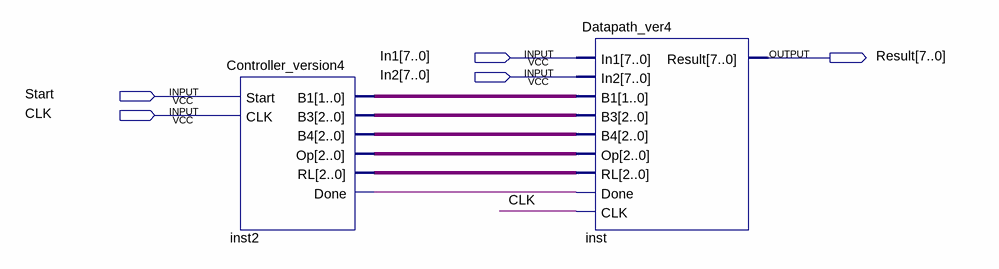
[diagram p0: schematic sheet]
// Quartus schematic version4.bdf as structural Verilog: 2 symbols, 5 pins
module version4 (
  input  [7:0] In1,
  input  [7:0] In2,
  input  Start,
  input  CLK,
  output [7:0] Result
);

  wire inst2_done;
  wire [1:0] inst2_b1;
  wire [2:0] inst2_b3, inst2_b4, inst2_op, inst2_rl;

  Controller_version4 inst2 (
    .Start(Start), .CLK(CLK), .B1(inst2_b1), .B3(inst2_b3), .B4(inst2_b4), .Op(inst2_op), .RL(inst2_rl),
    .Done(inst2_done));
  Datapath_ver4 inst (
    .In1(In1), .In2(In2), .B1(inst2_b1), .B3(inst2_b3), .B4(inst2_b4), .Op(inst2_op), .RL(inst2_rl),
    .Done(inst2_done), .CLK(CLK), .Result(Result));
endmodule
